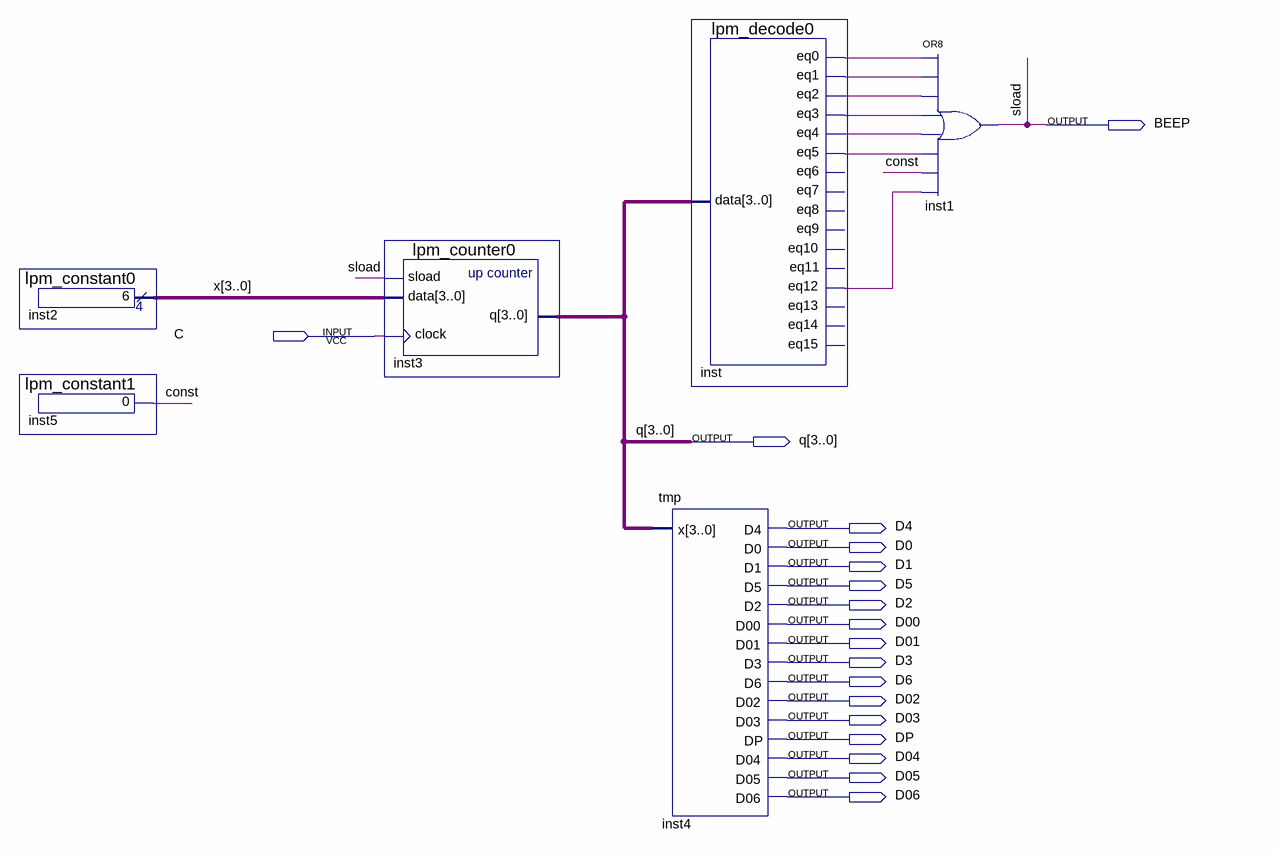
[diagram p0: schematic sheet]
// Quartus schematic Lab7_1.bdf as structural Verilog: 6 symbols, 18 pins
module Lab7_1 (
  input  C,
  output BEEP,
  output [3:0] q,
  output D4,
  output D0,
  output D1,
  output D5,
  output D2,
  output D00,
  output D01,
  output D3,
  output D6,
  output D02,
  output D03,
  output DP,
  output D04,
  output D05,
  output D06
);

  wire \const , inst_eq0, inst_eq1, inst_eq2, inst_eq3, inst_eq4, inst_eq5, inst_eq12;
  wire [3:0] x;

  lpm_constant0 inst2 (.result(x));
  lpm_constant1 inst5 (.result(\const ));
  lpm_counter0 inst3 (.sload(BEEP), .data(x), .clock(C), .q(q));
  lpm_decode0 inst (
    .data(q), .eq0(inst_eq0), .eq1(inst_eq1), .eq2(inst_eq2), .eq3(inst_eq3), .eq4(inst_eq4), .eq5(inst_eq5),
    .eq12(inst_eq12));  // open: eq6, eq7, eq8, eq9, eq10, eq11, eq13, eq14, eq15
  tmp inst4 (
    .x(q), .D4(D4), .D0(D0), .D1(D1), .D5(D5), .D2(D2), .D00(D00), .D01(D01), .D3(D3), .D6(D6), .D02(D02),
    .D03(D03), .DP(DP), .D04(D04), .D05(D05), .D06(D06));
  or inst1 (BEEP, inst_eq0, inst_eq1, inst_eq2, inst_eq3, inst_eq4, inst_eq5, \const , inst_eq12);

  // Other names for the same wires on the sheet: sload = BEEP
endmodule
